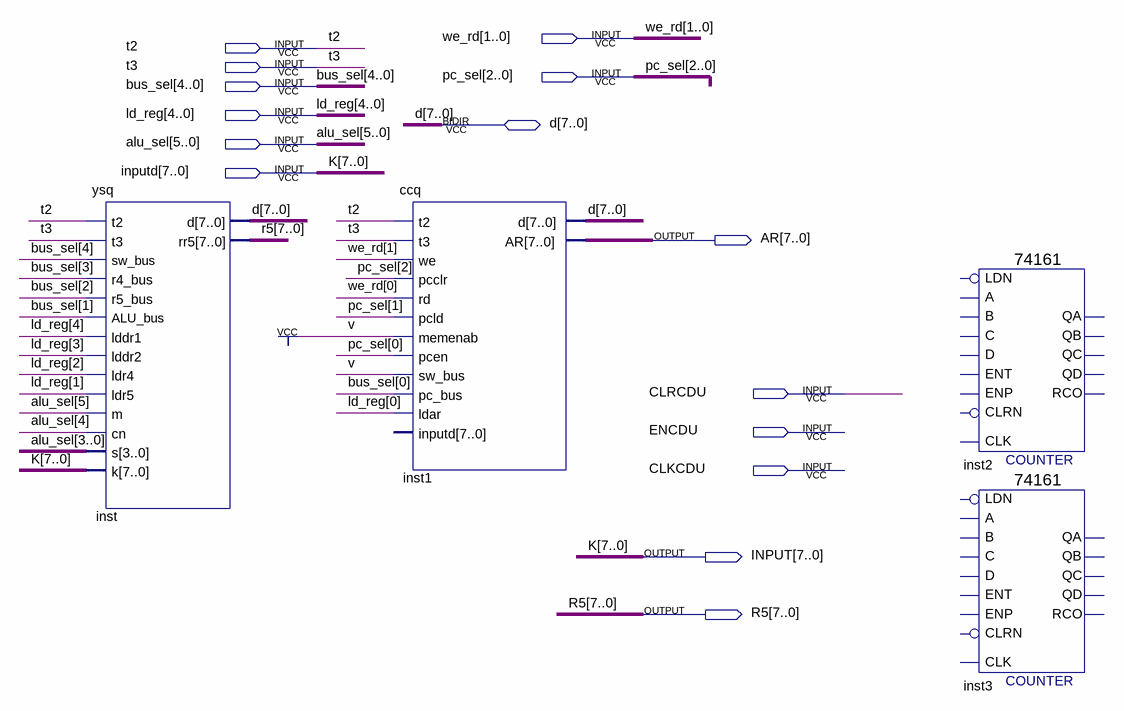
[diagram p0: schematic sheet]
// Quartus schematic SJTL.bdf as structural Verilog: 4 symbols, 15 pins
module SJTL (
  input  [1:0] we_rd,
  input  t2,
  input  t3,
  input  [2:0] pc_sel,
  input  [4:0] bus_sel,
  input  [4:0] ld_reg,
  input  [5:0] alu_sel,
  input  [7:0] inputd,
  input  CLRCDU,
  input  ENCDU,
  input  CLKCDU,
  inout  [7:0] d,
  output [7:0] AR,
  output [7:0] INPUT,
  output [7:0] R5
);

  ysq inst (
    .t2(t2), .t3(t3), .sw_bus(bus_sel[4]), .r4_bus(bus_sel[3]), .r5_bus(bus_sel[2]), .ALU_bus(bus_sel[1]),
    .lddr1(ld_reg[4]), .lddr2(ld_reg[3]), .ldr4(ld_reg[2]), .ldr5(ld_reg[1]), .m(alu_sel[5]),
    .cn(alu_sel[4]), .s(alu_sel[3:0]), .k(inputd), .rr5(R5), .d(d));
  ccq inst1 (
    .t2(t2), .t3(t3), .we(we_rd[1]), .pcclr(pc_sel[2]), .rd(we_rd[0]), .pcld(pc_sel[1]), .memenab(1'b1),
    .pcen(pc_sel[0]), .sw_bus(1'b1), .pc_bus(bus_sel[0]), .ldar(ld_reg[0]), .AR(AR), .d(d));  // open: inputd
  \74161  inst2 ();  // open: CLRN, CLK, ENP, LDN, A, D, ENT, B, C, QD, QC, QB, QA, RCO
  \74161  inst3 ();  // open: CLRN, CLK, ENP, LDN, A, D, ENT, B, C, QD, QC, QB, QA, RCO

  assign INPUT = inputd;

  // Other names for the same wires on the sheet: K[7:0] = inputd
endmodule
